# EasyEDA Pro project WKDoubleTXG0.epro

# Schematic Schematic1
Board Name: Board1; Create Date: 2025-02-15; Page Name: P1; Project Name: WKDoubleTXG0; Schematic Name: Schematic1; Update Date: 2025-02-16; Company: 嘉立创EDA; Page Size: A4; Version: V1.0
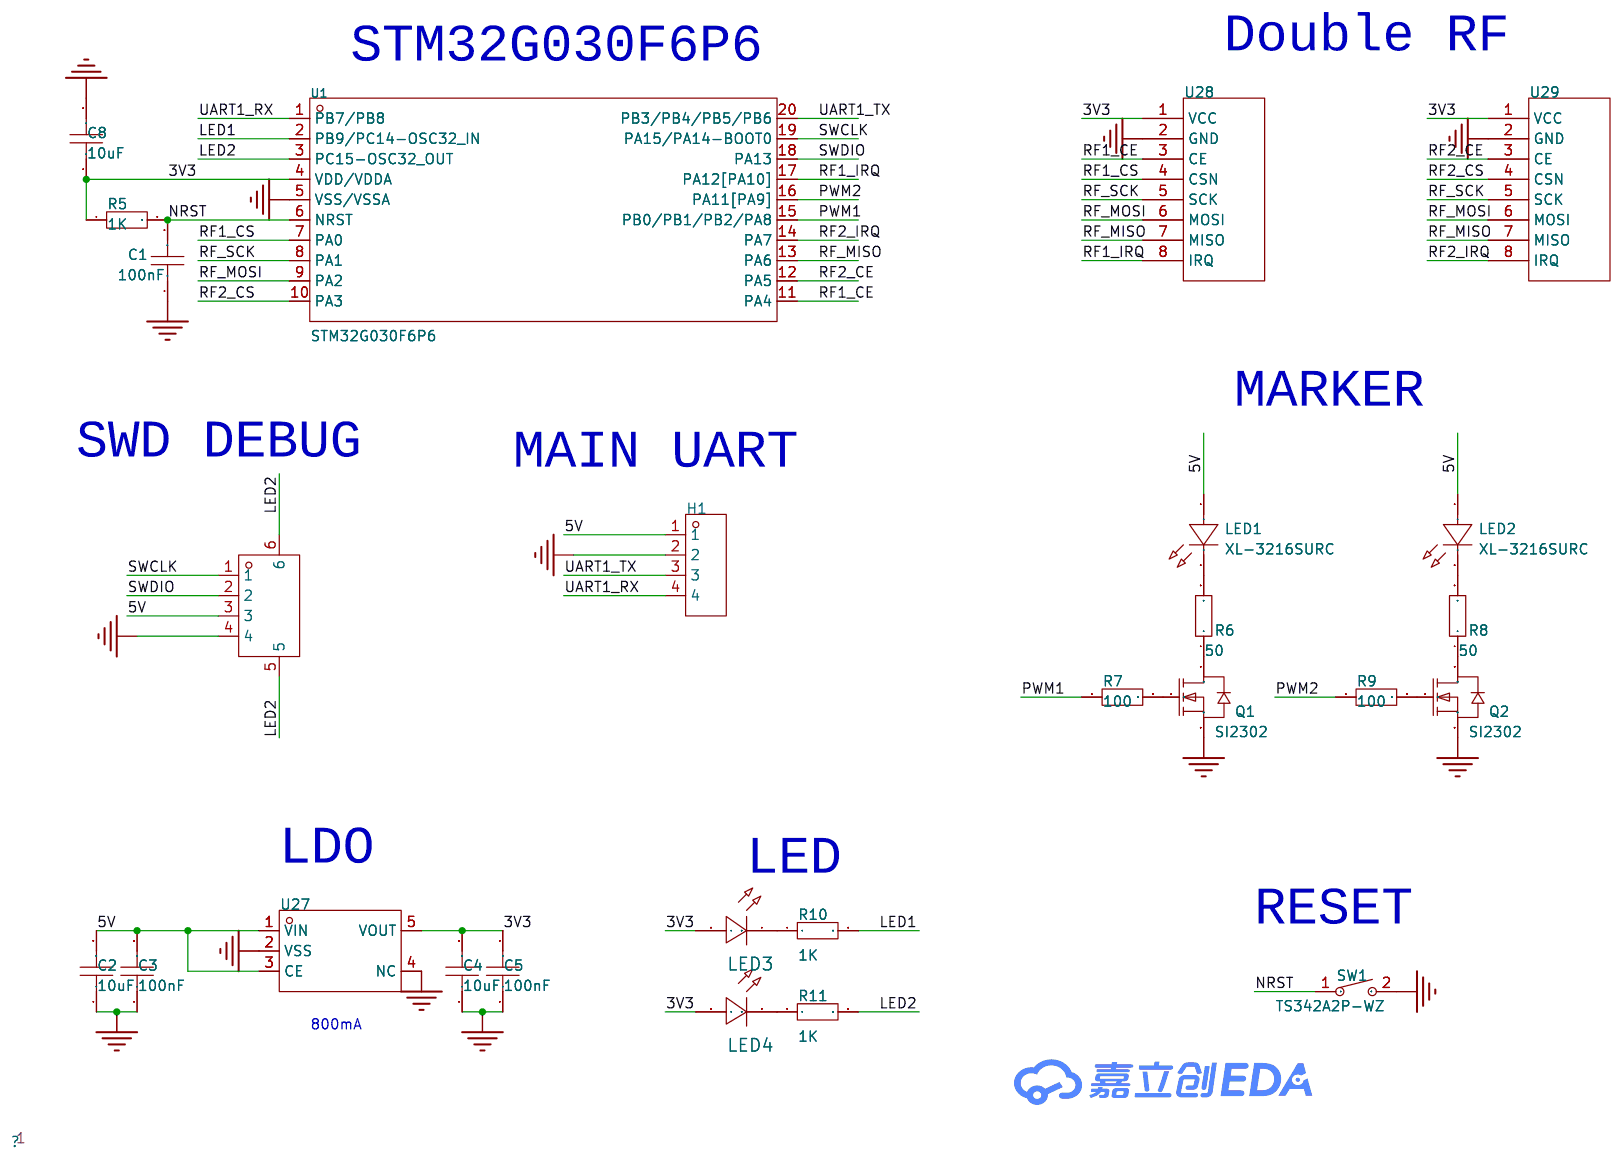
[diagram p0: schematic sheet]

## Parts
C1  100nF  [C0603]
C2  10uF  [C0603]
C3  100nF  [C0603]
C4  10uF  [C0603]
C5  100nF  [C0603]
C8  10uF  [C0603]
H1  -  [HDR-TH_4P-P2.54-V-F]
LED1  XL-3216SURC  [LED1206-R-RD_RED]
LED2  XL-3216SURC  [LED1206-R-RD_RED]
LED3  -  [LED_0603]
LED4  -  [LED_0603]
Q1  SI2302  [SOT-23-3_L2.9-W1.3-P1.90-LS2.4-BR]
Q2  SI2302  [SOT-23-3_L2.9-W1.3-P1.90-LS2.4-BR]
R5  1K  [R0603]
R6  50  [R0603]
R7  100  [R0603]
R8  50  [R0603]
R9  100  [R0603]
R10  1K  [R0603]
R11  1K  [R0603]
SW1  TS342A2P-WZ  [SW-SMD_L4.0-W2.9-LS5.0]
U1  STM32G030F6P6  [TSSOP-20_L6.5-W4.4-P0.65-LS6.4-BL]
U27  ME6217C33M5G  [SOT-23-5_L3.0-W1.7-P0.95-LS2.8-BR]
U28  -  [NF-03 SI24R1]
U29  -  [NF-03 SI24R1]
U41  ZX-SH1.0-4PWT  [CONN-SMD_4P-P1.00_MEGASTAR_ZX-SH1.0-4PWT]

## Library data of the parts
C1-C5 C8 = CAP_0603: Supplier Footprint: 0603
H1 = HDR-F_2.54_1x4P: Supplier Part: C2718488; Supplier Footprint: 插件
LED1 LED2 = XL-3216SURC: 发光颜色:红色;功率:55mW;正向电流:25mA;主波长:617nm~621nm;透镜颜色:无色透明透镜;色温:-;发光角度:120°;载带方式:正贴;工作温度:-30℃~+85℃;; Supplier Part: C965822; Manufacturer: XINGLIGHT(成兴光); Supplier Footprint: 1206; JLCPCB Part Class: 扩展库; Datasheet: https://atta.szlcsc.com/upload/public/pdf/source/20221102/38B682A5E5FDBBFCA7077B6272CE8E6F.pdf; Supplier: LCSC; Emitted Color: 红色; Power Dissipation: 55mW; Forward Current: 25mA; Dominant Wavelength: 617nm~621nm; Peak Wavelength: 623nm; Lens Color: 无色透明透镜; Viewing Angle: 120°; Mounting Sytle: 正贴; Operating Temperature: -30℃~+85℃
LED3 LED4 = LED_0603-R: Supplier Footprint: 0603
Q1 Q2 = SI2302: 类型:1个N沟道;漏源电压(Vdss):20V;连续漏极电流(Id):2.6A;导通电阻(RDS(on)@Vgs,Id):120mΩ@2.5V,2A;功率(Pd):900mW;阈值电压(Vgs(th)@Id):1.5V@250uA;; LCSC Part Name: 1个N沟道 耐压:20V 电流:2.6A; Supplier Part: C2841377; Manufacturer: TECH PUBLIC(台舟); Supplier Footprint: SOT-23-3; JLCPCB Part Class: 扩展库; Datasheet: https://atta.szlcsc.com/upload/public/pdf/source/20210810/B45106B571BB908B9120BCB1C1283335.pdf; Supplier: LCSC; Type: 1个N沟道; Drain Source Voltage (Vdss): 20V; Continuous Drain Current (Id): 2.6A; Drain Source On Resistance (RDS(on)@Vgs,Id): 120mΩ@2.5V,2A; Power Dissipation (Pd): 900mW; Gate Threshold Voltage (Vgs(th)@Id): 1.5V@250uA; Input Capacitance (Ciss@Vds): 880pF@6V; Operating Temperature: -40℃~+150℃
R5-R11 = Res_0603: Supplier Footprint: 0603
SW1 = TS342A2P-WZ: 电路结构:单刀单掷;按钮形状:圆形按钮;安装方式:立贴;开关长度:3.95mm;开关宽度:2.9mm;开关高度:2mm;带支架:不带;触点电流:50mA;额定电压(DC):12V;绝缘电阻:100MΩ;机械寿命:3万次;; LCSC Part Name: 3.95*2.9*2mm 立贴 轻触开关; Supplier Part: C557591; Manufacturer: SHOU HAN(首韩); Supplier Footprint: SMD; JLCPCB Part Class: 扩展库; Datasheet: https://atta.szlcsc.com/upload/public/pdf/source/20200519/C557591_B3A5A21584733303F06306F18577DA8B.pdf; Supplier: LCSC; Circuit: 单刀单掷; Actuator Style: 圆形按钮; Mounting Style: 立贴; Switch Length: 3.95mm; Switch Width: 2.9mm; Switch Height: 2mm; Strike Gundam: 不带; Contact Current: 50mA; Voltage Rating (DC): 12V; Insulation Resistance: 100MΩ; Actuator/Cap Color: 黑色; Pin Style: SMD接片; Mechanical Life: 3万次; Operating Temperature: -25℃~+70℃
U1 = STM32G030F6P6: CPU内核:CM0;程序存储容量:32KB;RAM总容量:8KB;GPIO端口数量:18;工作电压范围:2V~3.6V;CPU最大主频:64MHz;程序存储器类型:FLASH;; Supplier Part: C724040; Manufacturer: ST(意法半导体); Supplier Footprint: TSSOP-20; JLCPCB Part Class: 扩展库; Datasheet: https://atta.szlcsc.com/upload/public/pdf/source/20200511/C529329_A1CB615556C746C4EA827FCAD1461480.pdf; Supplier: LCSC; CPU Core: CM0; Program Storage Size: 32KB; RAM Size: 8KB; GPIO Ports Number: 18; Operating Voltage Range: 2V~3.6V; CPU Maximum Speed: 64MHz; Program Memory Type: FLASH; Operating Temperature Range: -40℃~+85℃; ADC (Bit): 12bit; Peripheral/Function: DMA；看门狗；看门狗; Internal Oscillator: 有
U27 = ME6217C33M5G: 输出类型:固定;输出极性:正;最大输入电压:7V;输出电压:3.3V;输出电流:800mA;电源纹波抑制比(PSRR):65dB@(1kHz);; Supplier Part: C427602; Manufacturer: MICRONE(南京微盟); Supplier Footprint: SOT-23-5; JLCPCB Part Class: 扩展库; Datasheet: https://atta.szlcsc.com/upload/public/pdf/source/20190910/C427602_D4B9162A2E9D9EF57C60010DFDECEF37.pdf; Supplier: LCSC; Output Type: 固定; Output Polarity: 正; Number of Outputs: 1; Maximum Input Voltage: 7V; Output Voltage: 3.3V; Dropout Voltage: 180mV@(300mA); Output Current: 800mA; Power Supply Rejection Ratio (PSRR): 65dB@(1kHz)
U28 U29 = NF-03 SI24R1
U41 = ZX-SH1.0-4PWT: 插针结构:1x4P;间距:1mm;安装方式:卧贴;参考系列:SH;总PIN数:4P;排数:1;每排PIN数:4;行距:-;额定电流:-;触头材质:黄铜;触头镀层:锡;工作温度范围:-;; LCSC Part Name: 1x4P 间距:1mm 卧贴 系列:SH; Supplier Part: C7430446; Manufacturer: Megastar(兆星); Supplier Footprint: SMD,P=1mm,卧贴; JLCPCB Part Class: 扩展库; Datasheet: https://atta.szlcsc.com/upload/public/pdf/source/20230619/390816C24B7A0EB1D042395C380CEA99.pdf; Supplier: LCSC; Pins Structure: 1x4P; Pitch: 1mm; Mounting Style: 卧贴; Reference Series: SH; Number of Pins: 4P; Number of Rows: 1; Number of PINs Per Row: 4; Contact Material: 黄铜; Contact Plating: 锡; Supplementary Features: 辅助焊脚; Colour: 米色; Z-Height of the Board: 3.15mm; X-Length of Bottom Edge on Board (Spacing Line): 6.35mm; Y-Width of Bottom Edge on Board: 5.05mm

## Nets
3V3: C4.2 C5.2 C8.1 LED3.2(A) LED4.2(A) R5.1 U1.4(VDD/VDDA) U27.5(VOUT) U28.1(VCC) U29.1(VCC)
5V: C2.2 C3.2 H1.1 LED1.1(K) LED2.1(K) U27.1(VIN) U27.3(CE) U41.3
GND: C1.1 C2.1 C3.1 C4.1 C5.1 C8.2 H1.2 Q1.2(S) Q2.2(S) SW1.2 U1.5(VSS/VSSA) U27.2(VSS) U27.4(NC) U28.2(GND) U29.2(GND) U41.4
LED1: R10.2 U1.2(PB9/PC14-OSC32_IN)
LED2: R11.2 U1.3(PC15-OSC32_OUT) U41.5 U41.6
NRST: C1.2 R5.2 SW1.1 U1.6(NRST)
PWM1: R7.1 U1.15(PB0/PB1/PB2/PA8)
PWM2: R9.1 U1.16(PA11[PA9])
RF1_CE: U1.11(PA4) U28.3(CE)
RF1_CS: U1.7(PA0) U28.4(CSN)
RF1_IRQ: U1.17(PA12[PA10]) U28.8(IRQ)
RF2_CE: U1.12(PA5) U29.3(CE)
RF2_CS: U1.10(PA3) U29.4(CSN)
RF2_IRQ: U1.14(PA7) U29.8(IRQ)
RF_MISO: U1.13(PA6) U28.7(MISO) U29.7(MISO)
RF_MOSI: U1.9(PA2) U28.6(MOSI) U29.6(MOSI)
RF_SCK: U1.8(PA1) U28.5(SCK) U29.5(SCK)
SWCLK: U1.19(PA15/PA14-BOOT0) U41.1
SWDIO: U1.18(PA13) U41.2
UART1_RX: H1.4 U1.1(PB7/PB8)
UART1_TX: H1.3 U1.20(PB3/PB4/PB5/PB6)
$1N990: Q1.3(D) R6.1
$1N1016: LED1.2(A) R6.2
$1N1078: Q1.1(G) R7.2
$1N1254: Q2.3(D) R8.1
$1N1256: LED2.2(A) R8.2
$1N1263: Q2.1(G) R9.2
$1N1474: LED3.1(C) R10.1
$1N1573: LED4.1(C) R11.1

## Notes on the sheet
- Double RF
- STM32G030F6P6
- MARKER
- SWD DEBUG
- MAIN UART
- LDO
- LED
- RESET
- 800mA

# Board PCB1
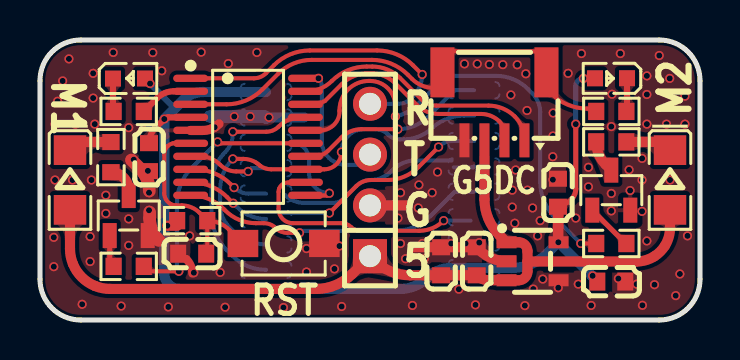
[diagram p1: board, top side]
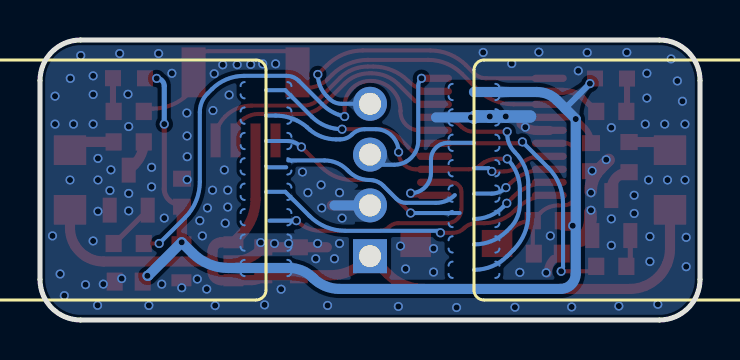
[diagram p2: board, bottom side, seen from below]

Outline 33 x 14 mm; copper layers: Top Layer, Bottom Layer. Coordinates in mm from the lower left corner of the outline.
Outline path: 0,11.97 0,2.03 arc(0.6,0.6) 2.03,0 30.97,0 arc(32.4,0.6) 33,2.03 33,11.97 arc(32.4,13.4) 30.97,14 2.03,14 arc(0.6,13.4) 0,11.97
Stack: Top Layer 0.035mm / Dielectric1 1.51mm FR4 er 4.5 / Bottom Layer 0.035mm

## Design rules (mm)
template: 自定义配置
spacing copperThickness1oz (default): track to track 0.102, other pairs 0.152 to 0.3
spacing copperThickness2oz: track to track 0.203, other pairs 0.152 to 0.3
track width copperThickness1oz (default): min 0.127, default 0.254, max 2.54
track width copperThickness2oz: min 0.203, default 0.254, max 2.54
differential pair differentialPair (default): width min 0.127, default 0.254, max 2.54; gap min 0.152, default 0.152
via viaSize (default): diameter min 0.254, default 0.457, max 10; hole min 0.3, default 0.305, max 6.299

## Placement (name value [footprint] x y rotation side)
C1  100nF  [C0603]  7.61 3.32 0 top
C2  10uF  [C0603]  20.06 2.94 270 top
C3  100nF  [C0603]  21.83 2.94 270 top
C4  10uF  [C0603]  25.9 6.36 270 top
C5  100nF  [C0603]  28.56 1.92 180 top
C8  10uF  [C0603]  5.45 8.14 270 top
H1  -  [HDR-TH_4P-P2.54-V-F]  16.5 7 90 top
LED1  XL-3216SURC  [LED1206-R-RD_RED]  1.5 7 270 top
LED2  XL-3216SURC  [LED1206-R-RD_RED]  31.5 7 270 top
LED3  -  [LED_0603]  4.5 12.08 0 top
LED4  -  [LED_0603]  28.5 12.08 180 top
Q1  SI2302  [SOT-23-3_L2.9-W1.3-P1.90-LS2.4-BR]  4.44 5.22 270 top
Q2  SI2302  [SOT-23-3_L2.9-W1.3-P1.90-LS2.4-BR]  28.56 6.49 270 top
R5  1K  [R0603]  7.61 4.97 0 top
R6  50  [R0603]  3.55 8.14 90 top
R7  100  [R0603]  4.44 2.68 180 top
R8  50  [R0603]  28.56 8.91 0 top
R9  100  [R0603]  28.56 3.83 0 top
R10  1K  [R0603]  4.44 10.43 0 top
R11  1K  [R0603]  28.56 10.43 180 top
SW1  TS342A2P-WZ  [SW-SMD_L4.0-W2.9-LS5.0]  12.18 3.83 0 top
U1  STM32G030F6P6  [TSSOP-20_L6.5-W4.4-P0.65-LS6.4-BL]  10.4 9.16 270 top
U27  ME6217C33M5G  [SOT-23-5_L3.0-W1.7-P0.95-LS2.8-BR]  24.63 2.94 180 top
U28  -  [NF-03 SI24R1]  11.3 7 270 bottom
U29  -  [NF-03 SI24R1]  21.7 7 90 bottom
U41  ZX-SH1.0-4PWT  [CONN-SMD_4P-P1.00_MEGASTAR_ZX-SH1.0-4PWT]  22.72 10.68 180 top

## Footprints (pads in the part's own frame, mm; a bottom-side part is the same pattern mirrored in y, then rotated)
C0603
  rect 0.8x0.9 smd: 1(-0.7,0) 2(0.7,0)
CONN-SMD_4P-P1.00_MEGASTAR_ZX-SH1.0-4PWT
  rect 0.5x1.7 smd: 1(-1.5,1.7) 2(-0.5,1.7) 3(0.5,1.7) 4(1.5,1.7)
  rect 1.2x2.5 smd: 5(2.6,-1.7) 6(-2.6,-1.7)
HDR-TH_4P-P2.54-V-F
  rect 1.7x1.7 hole 1.1: 1(-3.81,0)
  round 1.7 hole 1.1: 2(-1.27,0) 3(1.27,0) 4(3.81,0)
LED1206-R-RD_RED
  rect 1.485x1.62 smd: 1(1.492,0) 2(-1.492,0)
LED_0603
  rect 0.8x0.8 smd: 1(-0.851,-0.01) 2(0.75,-0.005)
NF-03 SI24R1
  custom 0.813x2.54 smd: 1(-4.4,0) 2(-3.13,0) 3(-1.86,0) 4(-0.59,0) 5(0.68,0) 6(1.95,0) 7(3.22,0) 8(4.49,0)
R0603
  rect 0.806x0.864 smd: 1(-0.753,0) 2(0.753,0)
SOT-23-3_L2.9-W1.3-P1.90-LS2.4-BR
  rect 1.25x0.7 smd: 1(1,-0.95) 2(1,0.95) 3(-1,0)
SOT-23-5_L3.0-W1.7-P0.95-LS2.8-BR
  rect 1x0.6 smd: 1(1.3,-0.95) 2(1.3,0) 3(1.3,0.95) 4(-1.3,0.95) 5(-1.3,-0.95)
SW-SMD_L4.0-W2.9-LS5.0
  rect 1.53x1.36 smd: 1(-2.035,0) 2(2.035,0)
TSSOP-20_L6.5-W4.4-P0.65-LS6.4-BL
  oval 0.364x1.742 smd: 1(-2.925,-2.871) 2(-2.275,-2.871) 3(-1.625,-2.871) 4(-0.975,-2.871) 5(-0.325,-2.871) 6(0.325,-2.871) 7(0.975,-2.871) 8(1.625,-2.871) 9(2.275,-2.871) 10(2.925,-2.871) 11(2.925,2.871) 12(2.275,2.871) 13(1.625,2.871) 14(0.975,2.871) 15(0.325,2.871) 16(-0.325,2.871) 17(-0.975,2.871) 18(-1.625,2.871) 19(-2.275,2.871) 20(-2.925,2.871)

## Nets
As in the schematic.

## Via types
v1: diameter 0.457, hole 0.305, Top Layer to Bottom Layer, 146 vias

## Routing (per net, layer and track width the routed paths; a pad name or vN(x,y) marks a point on that pad's centre or on a via; arc(x,y) is an arc through that point)
3V3: length 52.5
  Top Layer w0.254: LED4.2 27.75,12.08 v1(27.17,12.08) ; v1(26.79,9.79) 26.79,6.55 arc(26.56,6.01) 26.02,5.79 C4.2
  Top Layer w0.305: U1.4 6.42,10.13 arc(6.31,10.11) v1(6.21,10.05) 5.76,9.6 arc(5.53,9.25) C8.1
  Top Layer w0.508: 25.9,5.24 25.9,3.9 v1(25.92,3.89) 25.92,5.24 25.9,5.24 ; 25.9,5.24 C4.2 ; 6.86,4.71 v1(6.37,4.71)
  Bottom Layer w0.254: v1(26.79,9.79) 26.79,11.7 arc(26.9,11.97) v1(27.17,12.08)
  Bottom Layer w0.305: 6.75,10.58 6.74,10.58 v1(5.5,11.82)
  Bottom Layer w0.508: U28.1 8.16,11.4 arc(7.61,11.29) 7.15,10.98 v1(6.21,10.05) 6.21,2.31 arc(6.44,1.78) 6.97,1.55 18.02,1.55 arc(18.74,1.7) 19.35,2.11 arc(19.9,2.47) 20.54,2.6 U29.1 23.58,2.6 arc(24.55,2.79) 25.37,3.34 v1(25.92,3.89) 27.59,2.21 v1(27.63,2.21)
5V: length 43
  Top Layer w0.508: 22.22,8.09 22.22,6.04 arc(22.42,5.07) 22.97,4.25 U27.1 23.93,3.89 arc(24.24,3.76) 24.37,3.44 24.37,2.92 ; LED1.1 1.5,3.56 arc(1.54,3.17) 1.65,2.8 arc(2.09,2.14) 2.75,1.7 arc(3.12,1.59) 3.5,1.55 13.81,1.55 arc(14.78,1.75) 15.61,2.3 H1.1 16.71,2.98 arc(17.53,2.43) 18.51,2.24 C2.2 C3.2 arc(22.1,2.06) 22.42,1.99 23.13,1.99 U27.3 23.93,1.99 arc(24.24,2.12) 24.37,2.43 24.37,2.92 ; 24.37,2.92 29.82,2.92 arc(30.29,2.99) 30.72,3.18 arc(31.01,3.42) 31.24,3.71 arc(31.43,4.14) 31.5,4.6 LED2.1
GND: length 19
  Top Layer w0.406: 7.31,3.05 7.32,3.04 arc(7.54,2.71) 7.61,2.33
  Top Layer w0.457: 7.52,9.48 8.15,9.48 arc(8.45,9.52) v1(8.73,9.64) arc(8.85,9.72) 8.95,9.81
  Top Layer w0.508: 18.66,3.64 C2.1 C3.1 21.97,3.5 arc(22.59,3.08) U27.2 ; H1.2 18.41,5.73
  Top Layer w0.635: 4.57,8 5,7.57 arc(5.11,7.45) 5.2,7.33 arc(5.4,6.91) 5.47,6.45 ; 5.48,5.39 5.48,5.09 arc(5.53,4.72) 5.66,4.36 arc(5.78,4.16) 5.94,3.98
  Bottom Layer w0.508: U28.2 13.2,10.13 ; H1.2 18.28,5.73
  Bottom Layer w0.635: 8.5,10.17 v1(9.71,10.17) v1(10.51,10.17) 11.19,10.17 arc(11.25,10.16) 11.3,10.13 arc(11.3,10.13) U28.2
  vias: v1(0.75,7) v1(0.69,4.13) v1(0.69,2.67) v1(0.75,9.79) v1(0.88,10.94) v1(1.13,11.95) v1(1.45,13.06) v1(1.63,7) v1(1.77,9.79) v1(2.11,0.79) v1(2.5,4.17) v1(2.5,2.92) v1(2.57,7) v1(2.66,12.33) v1(2.66,11.1) v1(2.74,9.79) v1(3.29,6.24) v1(3.29,5.33) v1(3.66,13.38) v1(4.06,0.7) v1(4.44,9.62) v1(4.44,5.06) v1(4.44,3.73) v1(4.69,8.02) v1(5.39,7.46) v1(5.45,6.36) v1(5.45,5.49) v1(5.64,13.37) v1(6.09,12.46) v1(6.42,0.65) v1(7.48,4.21) v1(7.69,2.36) v1(8.06,13.39) v1(9.01,2.38) v1(9.25,0.64) v1(9.41,12.82) v1(10.84,13.38) v1(11.45,10.13) v1(12.17,0.62) v1(13.32,3.57) v1(13.32,2.4) v1(14.72,2.56) v1(14.98,3.7) v1(15.08,0.68) v1(17.9,5.09) v1(18.02,6.36) v1(18.02,3.83) v1(18.28,3.06) v1(18.62,0.73) v1(18.95,6.75) v1(18.91,5.6) v1(19.12,3.83) v1(19.21,3.06) v1(19.61,6.36) v1(19.88,7.4) v1(20.56,3.83) v1(20.94,1.54) v1(21.22,12.81) v1(21.28,3.83) v1(21.77,0.76) v1(21.86,12.81) v1(21.96,3.87) v1(22.47,12.78) v1(23.14,12.77) v1(23.54,11.25) v1(23.61,6.49) v1(23.61,5.65) v1(23.74,4.84) v1(23.78,7.5) v1(23.86,12.76) v1(24.24,0.72) v1(24.29,12.31) v1(24.35,10.47) v1(24.37,6.49) v1(24.63,5.6) v1(24.66,1.55) v1(24.88,4.21) v1(25.01,4.97) v1(25.14,2.05) v1(25.65,9.2) v1(25.64,8.17) v1(25.64,7.02) v1(25.66,10.35) v1(25.91,1.61) v1(26.41,12.33) v1(26.79,5.09) v1(26.91,1.79) v1(27.07,13.32) v1(27.42,7.64) v1(27.42,6.66) v1(27.56,0.73) v1(28.6,11.29) v1(28.56,9.67) v1(28.56,6.33) v1(28.56,5.46) v1(28.92,2.07) v1(29.02,13.32) v1(29.45,7.51) v1(29.5,6.47) v1(29.84,1.79) v1(30.1,8.08) v1(30.1,7) v1(30.1,5.43) v1(30.12,0.73) v1(30.34,12.21) v1(30.34,11.28) v1(30.34,9.79) v1(30.34,3.95) v1(30.72,1.77) v1(30.96,13.22) v1(31.33,9.79) v1(31.49,12.08) v1(31.5,7) v1(31.78,1.22) v1(31.99,2.3) v1(32.25,11.19) v1(32.25,9.79) v1(32.38,4.21)
LED1: length 2.7
  Top Layer w0.305: U1.2 6.68,11.43 arc(6.23,11.34) 5.85,11.09 R10.2
LED2: length 20.8
  Top Layer w0.203: 7.66,10.78 9.33,10.78 arc(10.3,10.98) 11.12,11.53 11.9,12.31 arc(12.68,12.82) 13.59,13.01 16.6,13.01 arc(17.57,12.81) 18.39,12.26 18.6,12.05 arc(19.1,11.72) 19.68,11.61 20.05,11.61 ; 27.77,10.57 27.35,10.57 arc(26.4,10.76) 25.58,11.3 ; 20.41,13.44 24.56,13.44 arc(24.94,13.37) 25.26,13.15
NRST: length 9.5
  Top Layer w0.203: R5.2 8.36,3.37 C1.2 ; R5.2 8.36,4.98 7.98,5.36 arc(7.57,5.63) 7.09,5.73 6.82,5.73 arc(6.66,5.75) 6.51,5.82 arc(6.39,5.91) 6.3,6.03 arc(6.23,6.17) 6.21,6.34 6.21,8.3 arc(6.25,8.5) 6.37,8.68 arc(6.37,8.69) 6.38,8.69 arc(6.5,8.78) 6.65,8.83 arc(6.7,8.84) 6.76,8.85 ; R5.2 arc(8.68,4.94) 8.98,4.84 arc(9.23,4.7) 9.46,4.52 SW1.1
PWM1: length 13.7
  Top Layer w0.203: R7.1 5.44,2.43 v1(6.94,2.43) ; U1.15 9.05,8.83 arc(8.96,8.85) v1(8.88,8.91)
  Bottom Layer w0.203: v1(8.88,8.91) 7.59,7.62 arc(7.04,6.79) 6.85,5.82 6.85,2.66 arc(6.85,2.65) 6.85,2.64 ; 6.85,2.64 arc(6.88,2.53) v1(6.94,2.43) arc(6.89,2.54) 6.85,2.64
PWM2: length 24.1
  Top Layer w0.203: v1(27.04,3.83) R9.1 ; v1(17.77,10.17) 17.77,10.68 arc(17.4,11.58) 16.5,11.95 16.44,11.95 arc(15.4,11.52) 14.98,10.49 14.98,10.43 arc(14.7,9.76) 14.03,9.48 U1.16
  Bottom Layer w0.203: v1(27.04,3.83) 25.75,5.11 arc(25.2,5.94) 25.01,6.91 25.01,10.4 arc(24.91,10.9) 24.63,11.32 24.4,11.55 arc(23.67,12.04) 22.8,12.21 20.67,12.21 arc(20.34,12.14) 20.06,11.95 18.89,10.79 arc(18.38,10.4) v1(17.77,10.17)
RF1_CE: length 6.1
  Top Layer w0.203: v1(14.47,6.34) 14.35,6.22 13.29,6.22 U1.11
  Bottom Layer w0.203: U28.3 12.61,8.86 arc(13.2,8.61) 13.45,8.02 13.45,7.36 arc(13.75,6.64) v1(14.47,6.34)
RF1_CS: length 4
  Top Layer w0.203: v1(10.41,7.43) 9.81,7.43 arc(9.38,7.52) 9.01,7.76 arc(8.54,8.07) 7.99,8.18 U1.7
  Bottom Layer w0.203: v1(10.41,7.43) 10.57,7.59 U28.4
RF1_IRQ: length 12.5
  Top Layer w0.203: v1(9.64,9.41) 11.31,9.41 arc(11.65,9.48) 11.93,9.67 arc(12.45,10.01) 13.06,10.13 U1.17
  Bottom Layer w0.203: U28.8 11.28,2.51 arc(10.4,2.69) 9.64,3.19 9.33,3.5 arc(8.78,4.33) 8.58,5.3 8.58,6.76 arc(8.76,7.65) 9.26,8.4 arc(9.54,8.82) 9.64,9.32 v1(9.64,9.41)
RF2_CE: length 12.4
  Top Layer w0.203: 13.01,6.87 12.4,6.87 arc(12.31,6.86) 12.23,6.84 arc(12.06,6.74) 11.96,6.57 arc(11.94,6.49) 11.93,6.41 11.93,5.56 arc(12.14,5.05) 12.64,4.84 15.09,4.84 arc(15.34,4.79) 15.55,4.65 arc(15.76,4.51) 16.01,4.46 18.96,4.46 arc(19.62,4.59) v1(20.18,4.97)
  Bottom Layer w0.203: v1(20.18,4.97) 21.53,4.97
RF2_CS: length 15.4
  Top Layer w0.203: v1(12.98,4.36) 12.35,4.36 arc(12.05,4.42) 11.8,4.59 arc(11.52,4.78) 11.19,4.84 10.79,4.84 arc(9.96,5.01) 9.26,5.48 9.19,5.55 arc(8.43,6.06) U1.10
  Bottom Layer w0.203: v1(12.98,4.36) 13.08,4.46 17.73,4.46 arc(18.71,4.65) 19.53,5.2 20.74,6.41 U29.4
RF2_IRQ: length 9.6
  Top Layer w0.203: U1.14 13.72,8.18 arc(14.1,8.26) 14.41,8.47 15.07,9.13 arc(15.53,9.43) 16.07,9.54 v1(17.9,9.54)
  Bottom Layer w0.203: U29.8 20.74,11.49 19.41,10.17 arc(18.72,9.7) v1(17.9,9.54)
RF_MISO: length 19.6
  Top Layer w0.203: v1(9.64,8.06) 10.17,8.06 arc(10.5,8.01) 10.8,7.87 arc(10.85,7.84) 10.89,7.81 arc(10.94,7.76) 11,7.72 ; 11,7.72 arc(11,7.71) 11.01,7.71 ; 11,7.72 arc(11.26,7.58) 11.56,7.53 U1.13 14.21,7.53 arc(14.82,7.79) v1(15.07,8.4)
  Bottom Layer w0.203: U29.7 21.22,10.22 arc(20.67,10.16) 20.14,9.97 arc(19.88,9.82) 19.65,9.64 arc(19.58,9.58) 19.51,9.51 arc(18.89,9.16) 18.2,9.03 17.99,9.03 arc(17.67,9.1) 17.4,9.28 arc(17.11,9.47) 16.76,9.54 16.21,9.54 arc(15.41,9.21) v1(15.07,8.4) ; U28.7 11.28,3.78 arc(10.4,3.96) 9.64,4.46 9.5,4.61 arc(9.13,5.15) 9.01,5.79 9.01,6.53 arc(9.17,7.35) v1(9.64,8.06)
RF_MOSI: length 15.3
  Top Layer w0.203: v1(9.66,5.84) 9.36,6.14 arc(8.84,6.54) 8.23,6.79 arc(7.9,6.86) 7.56,6.88 U1.9 ; v1(14.47,5.35) 15.81,6.69 arc(16.15,6.92) 16.55,7 17.37,7 arc(18.21,7.17) 18.92,7.64 v1(19.93,8.65)
  Bottom Layer w0.203: v1(14.47,5.35) 12.02,5.35 ; v1(9.66,5.84) 9.85,5.65 arc(10.51,5.21) U28.6 ; U29.6 20.65,8.95 arc(20.26,8.87) v1(19.93,8.65)
RF_SCK: length 14.3
  Top Layer w0.203: U1.8 7.74,7.53 arc(8.71,7.34) 9.53,6.79 v1(9.7,6.62)
  Bottom Layer w0.203: U28.5 10.43,6.32 arc(10.04,6.4) v1(9.7,6.62) ; 20.59,7.98 18.78,7.98 arc(18.16,7.86) 17.64,7.51 17.57,7.43 arc(17.09,7.11) 16.52,7 arc(16.15,6.93) 15.83,6.72 15.17,6.06 arc(14.95,5.91) 14.7,5.86 13.2,5.86 arc(12.69,5.96) 12.26,6.25 ; U29.5 21.66,7.64 20.69,7.64
SWCLK: length 12.9
  Top Layer w0.203: U1.19 13.34,11.43 arc(14.02,11.57) 14.59,11.95 arc(15.39,12.49) 16.33,12.67 16.62,12.67 arc(17.37,12.52) 18.01,12.1 19.08,11.03 arc(19.42,10.8) 19.82,10.72 22.42,10.72 arc(23.14,10.58) 23.74,10.17 arc(24.1,9.64) 24.22,9.01 U41.1
SWDIO: length 12
  Top Layer w0.203: U41.2 23.22,9.33 arc(23.16,9.65) 22.98,9.92 arc(22.55,10.2) 22.06,10.3 19.93,10.3 arc(19.34,10.42) 18.84,10.75 17.77,11.83 arc(17.21,12.2) 16.54,12.33 16.4,12.33 arc(15.69,12.19) 15.08,11.79 14.25,10.95 arc(13.91,10.83) 13.55,10.78 U1.18
UART1_RX: length 15.9
  Top Layer w0.203: v1(19.11,12.28) 18.65,12.73 arc(17.83,13.28) 16.86,13.48 13.49,13.48 arc(12.52,13.28) 11.69,12.73 11.29,12.33 arc(11.02,12.15) 10.69,12.08 U1.1
  Bottom Layer w0.203: H1.4 17.92,10.81 arc(18.25,10.88) 18.53,11.06 18.66,11.19 arc(18.99,11.69) v1(19.11,12.28)
UART1_TX: length 7.1
  Top Layer w0.203: U1.20 v1(13.93,12.08)
  Bottom Layer w0.203: H1.3 15.99,7.76 15.28,7.76 arc(14.98,7.8) 14.69,7.92 arc(14.44,8.11) 14.24,8.37 arc(14.13,8.65) 14.09,8.96 14.09,11.69 arc(14.05,11.91) v1(13.93,12.08)
$1N990: length 1.7
  Top Layer w0.508: Q1.3 4.44,6.5 arc(4.17,7.13) R6.1
$1N1016: length 2.2
  Top Layer w0.508: R6.2 1.9,8.9 LED1.2
$1N1078: length 1.6
  Top Layer w0.254: R7.2 3.49,2.88 Q1.1
$1N1254: length 1.7
  Top Layer w0.508: Q2.3 28.28,7.78 arc(27.93,8.3) R8.1
$1N1256: length 2.4
  Top Layer w0.508: R8.2 31.09,8.91 LED2.2
$1N1263: length 2.4
  Top Layer w0.254: Q2.1 29.28,3.83 R9.2
$1N1474: length 1.7
  Top Layer w0.305: LED3.1 3.65,10.46 R10.1
$1N1573: length 1.7
  Top Layer w0.305: LED4.1 29.35,10.46 R11.1

## Copper pours and planes (outline as drawn; the poured copper is in the pictures)
GND on Top Layer: 24.75,8.27 26.3,8.27 26.3,6.36 24.75,6.36
GND on Top Layer: 25.01,2.37 27.04,2.37 27.04,1.33 25.01,1.33
GND on Top Layer: 20.06,4.33 22.1,4.33 22.1,2.87 20.06,2.87
GND on Top Layer: 28.61,2.37 30.76,2.37 30.76,1.32 28.61,1.32
GND on Top Layer: -1.41,14.87 35.04,14.87 35.04,-1 -1.41,-1
GND on Top Layer: 20.52,9.83 21.64,9.83 21.64,6.53 20.52,6.53
GND on Top Layer: 5.82,3.73 7.51,3.73 7.51,2.86 5.82,2.86
GND on Top Layer: 12.88,3.83 15.23,3.83 15.23,2.81 12.88,2.81
GND on Top Layer: 19.09,4.05 21.1,4.05 21.1,2.89 19.09,2.89
GND on Top Layer: 5.62,4.12 7.52,4.12 7.52,3.32 5.62,3.32
GND on Top Layer: 4.44,5.2 5.8,5.2 5.8,3.32 4.44,3.32
GND on Top Layer: 16.48,6.51 18.6,6.51 18.6,4.92 16.48,4.92
GND on Bottom Layer: -1.53,14.75 35.04,14.75 35.04,-1.13 -1.53,-1.13
GND on Bottom Layer: 16.49,6.52 18.08,6.52 18.08,4.91 16.49,4.91
GND on Bottom Layer: 19.93,4.33 23.61,4.33 23.61,3.19 19.93,3.19

Small or netless copper shapes (teardrops, artwork), in the pictures only: 89 on Top Layer, 36 on Bottom Layer

## Text on the board
Top Silkscreen Layer: G5DC | RST | R | T | G | 5 | M2 | M1
